# EAGLE design Aux Power Board V1 (EAGLE 9.2.2)

## Sheet 1 of 3
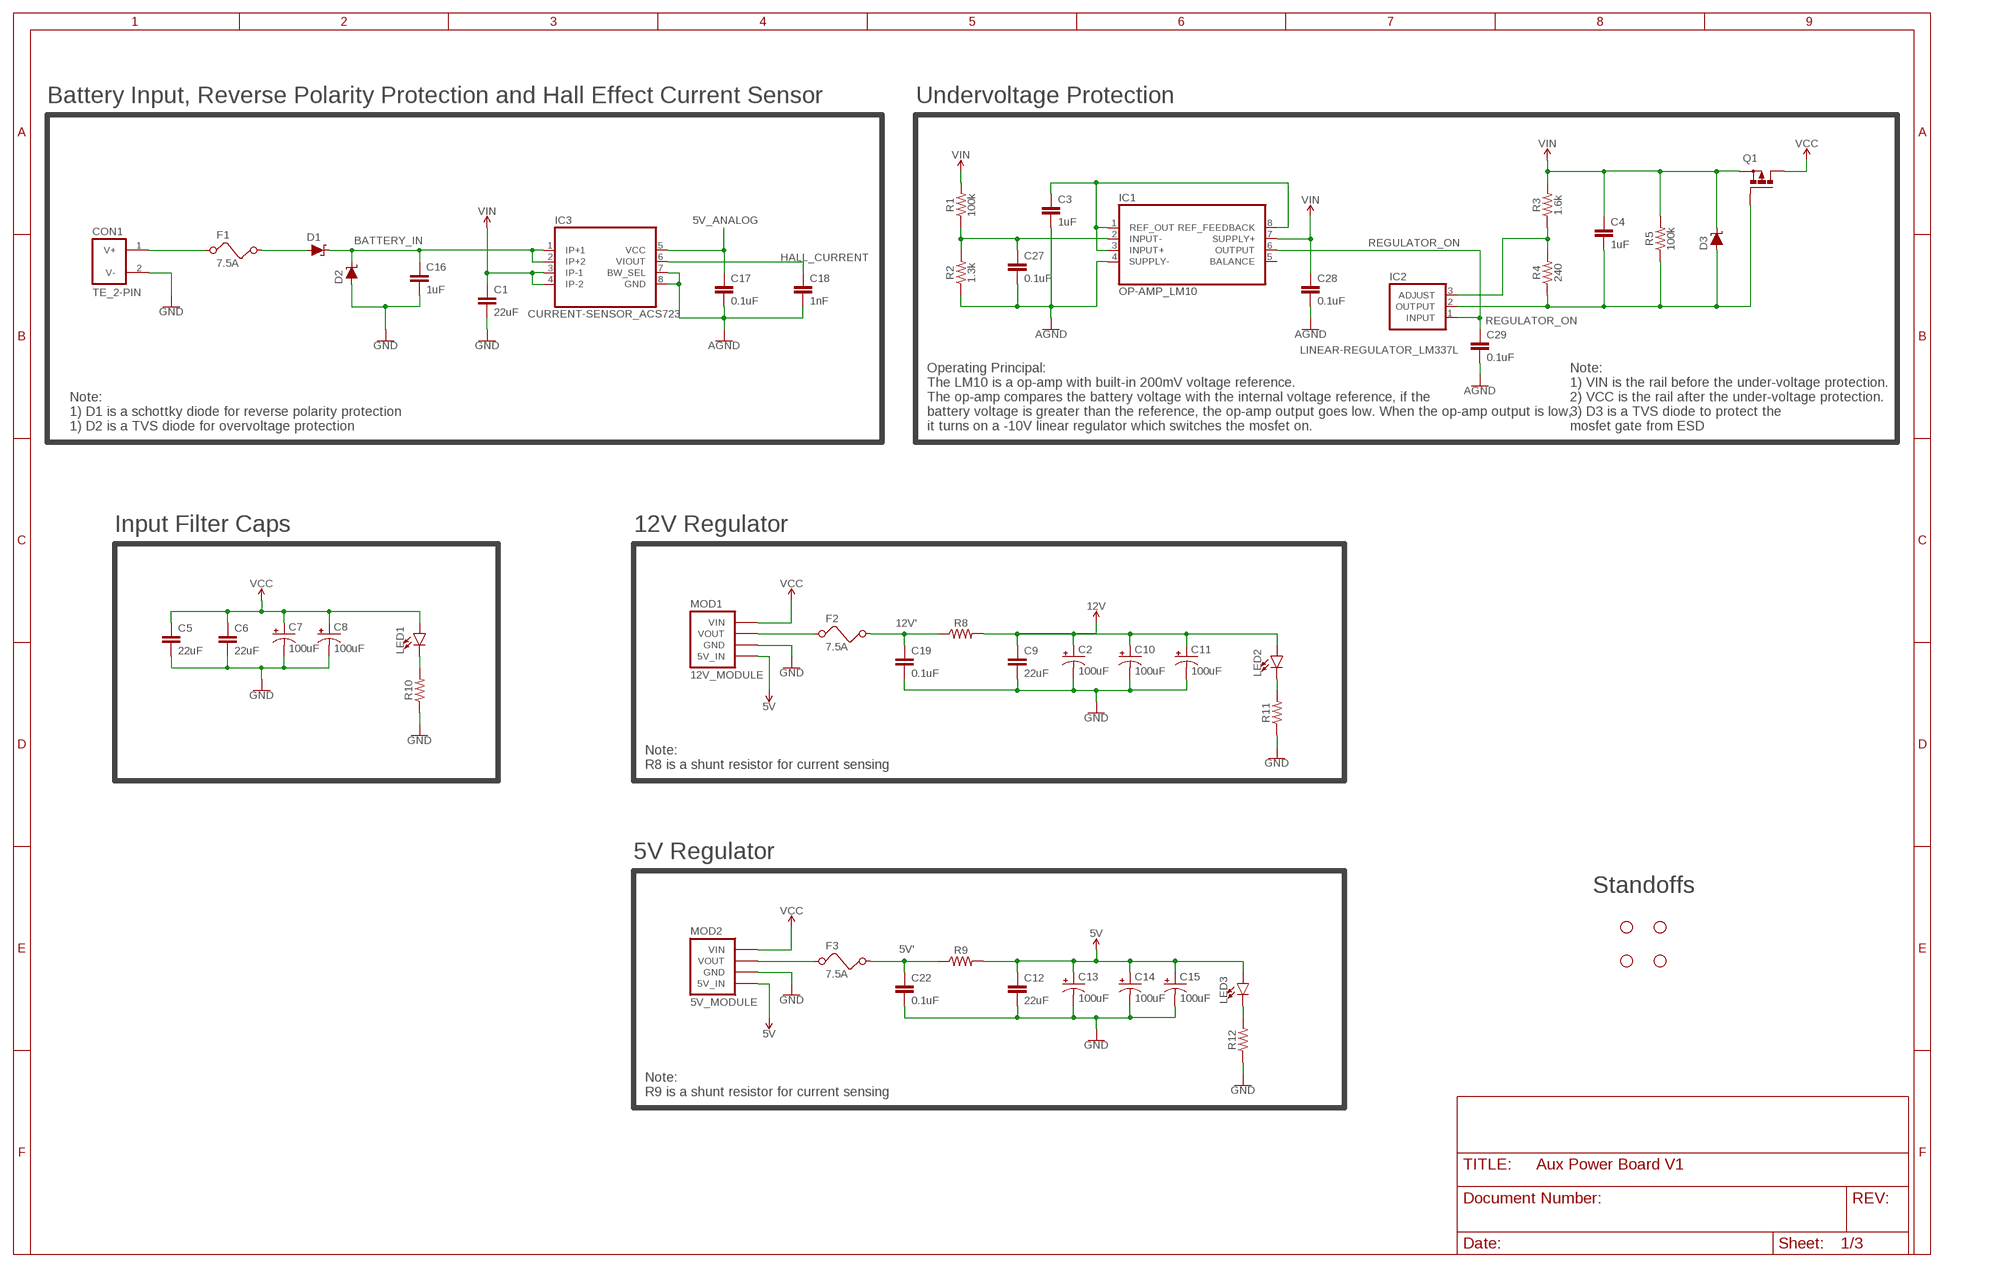
[diagram p0: schematic, sheet 1]

### Parts
C1  22uF  CAPACITOR_1210  [1210]
C2  100uF  CAPACITOR_ELECTROLYTIC_100UF  [CAPACITOR_100UF_50V]
C3  1uF  CAPACITOR_0805  [0805]
C4  1uF  CAPACITOR_0805  [0805]
C5  22uF  CAPACITOR_1210  [1210]
C6  22uF  CAPACITOR_1210  [1210]
C7  100uF  CAPACITOR_ELECTROLYTIC_100UF  [CAPACITOR_100UF_50V]
C8  100uF  CAPACITOR_ELECTROLYTIC_100UF  [CAPACITOR_100UF_50V]
C9  22uF  CAPACITOR_0805  [0805]
C10  100uF  CAPACITOR_ELECTROLYTIC_100UF  [CAPACITOR_100UF_50V]
C11  100uF  CAPACITOR_ELECTROLYTIC_100UF  [CAPACITOR_100UF_50V]
C12  22uF  CAPACITOR_0805  [0805]
C13  100uF  CAPACITOR_ELECTROLYTIC_100UF  [CAPACITOR_100UF_50V]
C14  100uF  CAPACITOR_ELECTROLYTIC_100UF  [CAPACITOR_100UF_50V]
C15  100uF  CAPACITOR_ELECTROLYTIC_100UF  [CAPACITOR_100UF_50V]
C16  1uF  CAPACITOR_0805  [0805]
C17  0.1uF  CAPACITOR_0805  [0805]
C18  1nF  CAPACITOR_0805  [0805]
C19  0.1uF  CAPACITOR_0805  [0805]
C22  0.1uF  CAPACITOR_0805  [0805]
C27  0.1uF  CAPACITOR_0805  [0805]
C28  0.1uF  CAPACITOR_0805  [0805]
C29  0.1uF  CAPACITOR_0805  [0805]
CON1  TE_2-PIN  [TE_2-PIN]
D1  DIODE_SCHOTTKY_TO-263  [TO-263/D2PAK]
D2  DIODE_TVS_DO-214AA  [DO214AA]
D3  DIODE_TVS_DO-214AA  [DO214AA]
F1  7.5A  FUSEHOLDER_VERTICAL  [FUSEHOLDER_VERTICAL]
F2  7.5A  FUSEHOLDER_VERTICAL  [FUSEHOLDER_VERTICAL]
F3  7.5A  FUSEHOLDER_VERTICAL  [FUSEHOLDER_VERTICAL]
H1  STAND-OFF  [STAND-OFF]
H2  STAND-OFF  [STAND-OFF]
H3  STAND-OFF  [STAND-OFF]
H4  STAND-OFF  [STAND-OFF]
IC1  OP-AMP_LM10  [DIP08]
IC2  LINEAR-REGULATOR_LM337L  [TO92]
IC3  CURRENT-SENSOR_ACS723  [SOIC8]
LED1  LED_0805  [0805_LED]
LED2  LED_0805  [0805_LED]
LED3  LED_0805  [0805_LED]
MOD1  12V_MODULE  [5/12V_MODULE]
MOD2  5V_MODULE  [5/12V_MODULE]
Q1  MOSFET_PMOS_TO-263  [TO-263/D2PAK]
R1  100k  RESISTOR_0805  [0805]
R2  1.3k  RESISTOR_0805  [0805]
R3  1.6k  RESISTOR_0805  [0805]
R4  240  RESISTOR_0805  [0805]
R5  100k  RESISTOR_0805  [0805]
R8  RESISTOR_1210  [1210]
R9  RESISTOR_1210  [1210]
R10  RESISTOR_0805  [0805]
R11  RESISTOR_0805  [0805]
R12  RESISTOR_0805  [0805]

### Nets
5V: C12.1 C13.+ C14.+ C15.+ LED3.1(A) MOD1.P$32(5V_IN) MOD2.P$32(5V_IN) R9.2 ; also sheet 2,3
5V': C22.1 F3.3 F3.4 R9.1 ; also sheet 3
5V_ANALOG: C17.1 IC3.5(VCC) ; also sheet 3
12V: C2.+ C9.1 C10.+ C11.+ LED2.1(A) R8.2 ; also sheet 2,3
12V': C19.1 F2.3 F2.4 R8.1 ; also sheet 3
AGND: C3.2 C17.2 C18.2 C27.2 C28.2 C29.2 IC1.4(SUPPLY-) IC3.7(BW_SEL) IC3.8(GND) R2.1 ; also sheet 3
BATTERY_IN: C16.1 D1.2(C) D2.C IC3.1(IP+1) IC3.2(IP+2) ; also sheet 3
GND: C1.2 C2.- C5.2 C6.2 C7.- C8.- C9.2 C10.- C11.- C12.2 C13.- C14.- C15.- C16.2 C19.2 C22.2 CON1.2(V-) D2.A MOD1.P$25(GND) MOD1.P$26(GND) MOD1.P$27(GND) MOD1.P$28(GND) MOD1.P$29(GND) MOD1.P$30(GND) MOD1.P$31(GND) MOD2.P$25(GND) MOD2.P$26(GND) MOD2.P$27(GND) MOD2.P$28(GND) MOD2.P$29(GND) MOD2.P$30(GND) MOD2.P$31(GND) R10.1 R11.1 R12.1 ; also sheet 2,3
HALL_CURRENT: C18.1 IC3.6(VIOUT) ; also sheet 3
N$2: CON1.1(V+) F1.1 F1.2
N$3: D1.3(A) F1.3 F1.4
N$4: LED1.2(C) R10.2
N$5: C3.1 IC1.1(REF_OUT) IC1.3(INPUT+) IC1.8(REF_FEEDBACK)
N$6: C27.1 IC1.2(INPUT-) R1.1 R2.2
N$7: F2.1 F2.2 MOD1.P$9(VOUT) MOD1.P$10(VOUT) MOD1.P$11(VOUT) MOD1.P$12(VOUT) MOD1.P$13(VOUT) MOD1.P$14(VOUT) MOD1.P$15(VOUT) MOD1.P$16(VOUT) MOD1.P$17(VOUT) MOD1.P$18(VOUT) MOD1.P$19(VOUT) MOD1.P$20(VOUT) MOD1.P$21(VOUT) MOD1.P$22(VOUT) MOD1.P$23(VOUT) MOD1.P$24(VOUT)
N$8: C4.2 D3.A IC2.2(OUTPUT) Q1.1(G) R4.1 R5.1
N$9: IC2.3(ADJUST) R3.1 R4.2
N$11: F3.1 F3.2 MOD2.P$9(VOUT) MOD2.P$10(VOUT) MOD2.P$11(VOUT) MOD2.P$12(VOUT) MOD2.P$13(VOUT) MOD2.P$14(VOUT) MOD2.P$15(VOUT) MOD2.P$16(VOUT) MOD2.P$17(VOUT) MOD2.P$18(VOUT) MOD2.P$19(VOUT) MOD2.P$20(VOUT) MOD2.P$21(VOUT) MOD2.P$22(VOUT) MOD2.P$23(VOUT) MOD2.P$24(VOUT)
N$13: LED3.2(C) R12.2
N$17: LED2.2(C) R11.2
REGULATOR_ON: C29.1 IC1.6(OUTPUT) IC2.1(INPUT)
VCC: C5.1 C6.1 C7.+ C8.+ LED1.1(A) MOD1.P$1(VIN) MOD1.P$2(VIN) MOD1.P$3(VIN) MOD1.P$4(VIN) MOD1.P$5(VIN) MOD1.P$6(VIN) MOD1.P$7(VIN) MOD1.P$8(VIN) MOD2.P$1(VIN) MOD2.P$2(VIN) MOD2.P$3(VIN) MOD2.P$4(VIN) MOD2.P$5(VIN) MOD2.P$6(VIN) MOD2.P$7(VIN) MOD2.P$8(VIN) Q1.2(D) ; also sheet 3
VIN: C1.1 C4.1 C28.1 D3.C IC1.7(SUPPLY+) IC3.3(IP-1) IC3.4(IP-2) Q1.3(S) R1.2 R3.2 R5.2
Unconnected: IC1.5(BALANCE)

### Notes on the sheet
- Battery Input, Reverse Polarity Protection and Hall Effect Current Sensor | Undervoltage Protection
- Note: 
  1) D1 is a schottky diode for reverse polarity protection
  1) D2 is a TVS diode for overvoltage protection
- Operating Principal: 
  The LM10 is a op-amp with built-in 200mV voltage reference.
  The op-amp compares the battery voltage with the internal voltage reference, if the 
  battery voltage is greater than the reference, the op-amp output goes low. When the op-amp output is low, 
  it turns on a -10V linear regulator which switches the mosfet on.
- Note: 
  1) VIN is the rail before the under-voltage protection.
  2) VCC is the rail after the under-voltage protection.
  3) D3 is a TVS diode to protect the
  mosfet gate from ESD
- Input Filter Caps | 12V Regulator
- Note: 
  R8 is a shunt resistor for current sensing
- 5V Regulator
- Standoffs
- Note: 
  R9 is a shunt resistor for current sensing

## Sheet 2 of 3
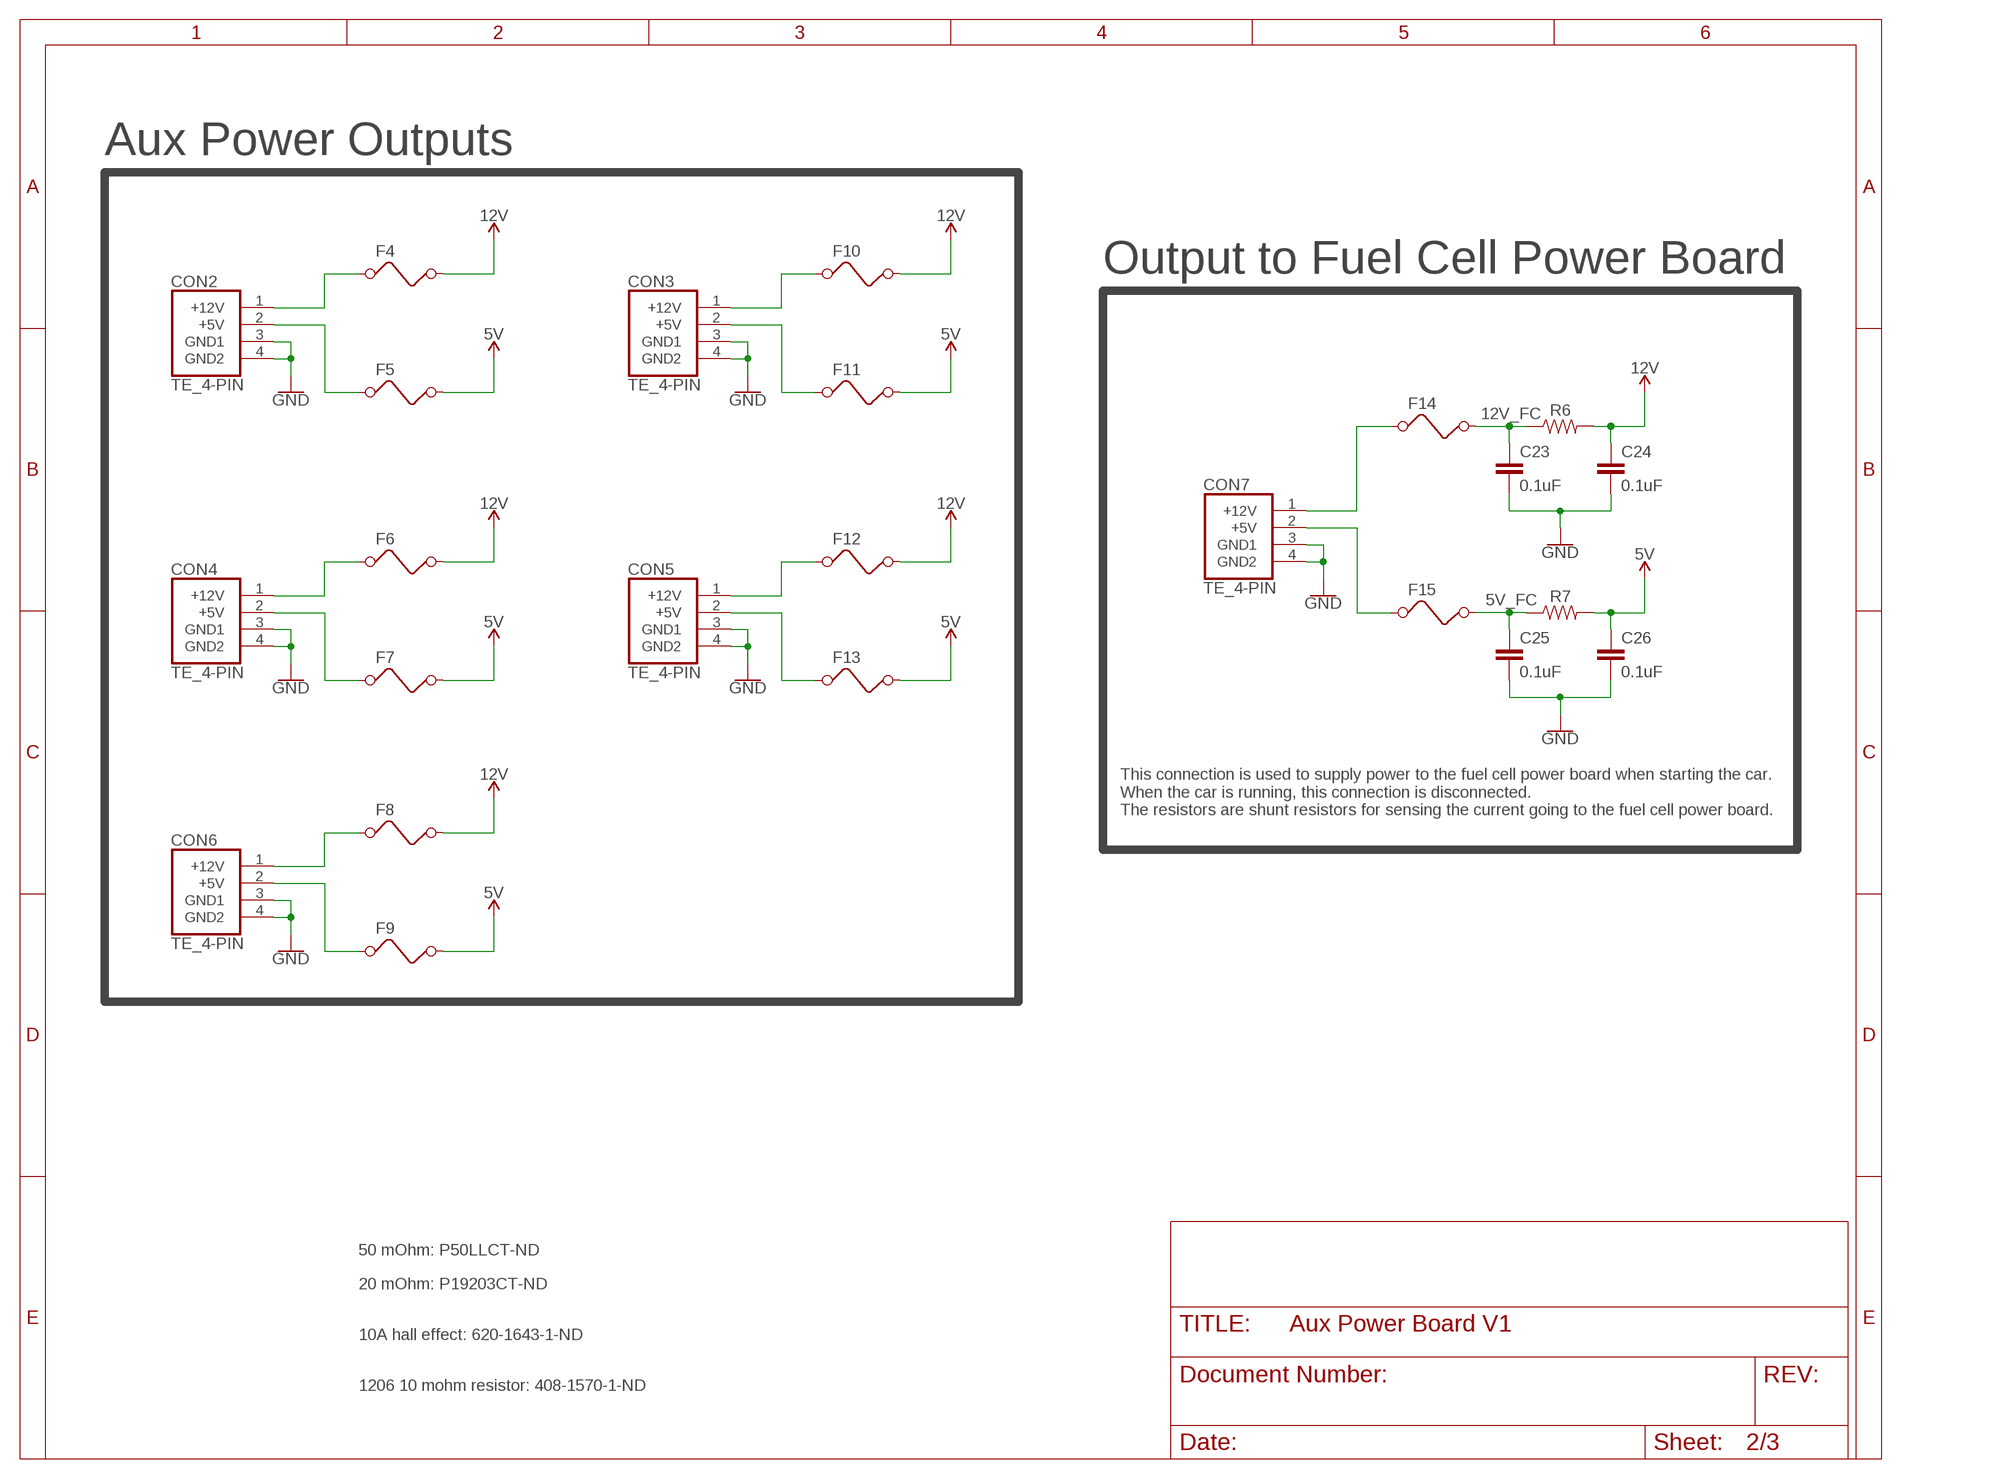
[diagram p1: schematic, sheet 2]

### Parts
C23  0.1uF  CAPACITOR_0805  [0805]
C24  0.1uF  CAPACITOR_0805  [0805]
C25  0.1uF  CAPACITOR_0805  [0805]
C26  0.1uF  CAPACITOR_0805  [0805]
CON2  TE_4-PIN  [TE_4-PIN]
CON3  TE_4-PIN  [TE_4-PIN]
CON4  TE_4-PIN  [TE_4-PIN]
CON5  TE_4-PIN  [TE_4-PIN]
CON6  TE_4-PIN  [TE_4-PIN]
CON7  TE_4-PIN  [TE_4-PIN]
F4  FUSE_1210  [1210]
F5  FUSE_1210  [1210]
F6  FUSE_1210  [1210]
F7  FUSE_1210  [1210]
F8  FUSE_1210  [1210]
F9  FUSE_1210  [1210]
F10  FUSE_1210  [1210]
F11  FUSE_1210  [1210]
F12  FUSE_1210  [1210]
F13  FUSE_1210  [1210]
F14  FUSE_1210  [1210]
F15  FUSE_1210  [1210]
R6  RESISTOR_1210  [1210]
R7  RESISTOR_1210  [1210]

### Nets
5V: C26.1 F5.2 F7.2 F9.2 F11.2 F13.2 R7.2 ; also sheet 1,3
5V_FC: C25.1 F15.2 R7.1 ; also sheet 3
12V: C24.1 F4.2 F6.2 F8.2 F10.2 F12.2 R6.2 ; also sheet 1,3
12V_FC: C23.1 F14.2 R6.1 ; also sheet 3
GND: C23.2 C24.2 C25.2 C26.2 CON2.3(GND1) CON2.4(GND2) CON3.3(GND1) CON3.4(GND2) CON4.3(GND1) CON4.4(GND2) CON5.3(GND1) CON5.4(GND2) CON6.3(GND1) CON6.4(GND2) CON7.3(GND1) CON7.4(GND2) ; also sheet 1,3
N$1: CON2.1(+12V) F4.1
N$10: CON2.2(+5V) F5.1
N$15: CON3.2(+5V) F11.1
N$16: CON3.1(+12V) F10.1
N$19: CON5.2(+5V) F13.1
N$20: CON5.1(+12V) F12.1
N$23: CON4.2(+5V) F7.1
N$24: CON4.1(+12V) F6.1
N$27: CON6.2(+5V) F9.1
N$28: CON6.1(+12V) F8.1
N$31: CON7.2(+5V) F15.1
N$32: CON7.1(+12V) F14.1

### Notes on the sheet
- Aux Power Outputs
- Output to Fuel Cell Power Board
- This connection is used to supply power to the fuel cell power board when starting the car. 
  When the car is running, this connection is disconnected.
  The resistors are shunt resistors for sensing the current going to the fuel cell power board.
- 50 mOhm: P50LLCT-ND
- 20 mOhm: P19203CT-ND
- 10A hall effect: 620-1643-1-ND
- 1206 10 mohm resistor: 408-1570-1-ND

## Sheet 3 of 3
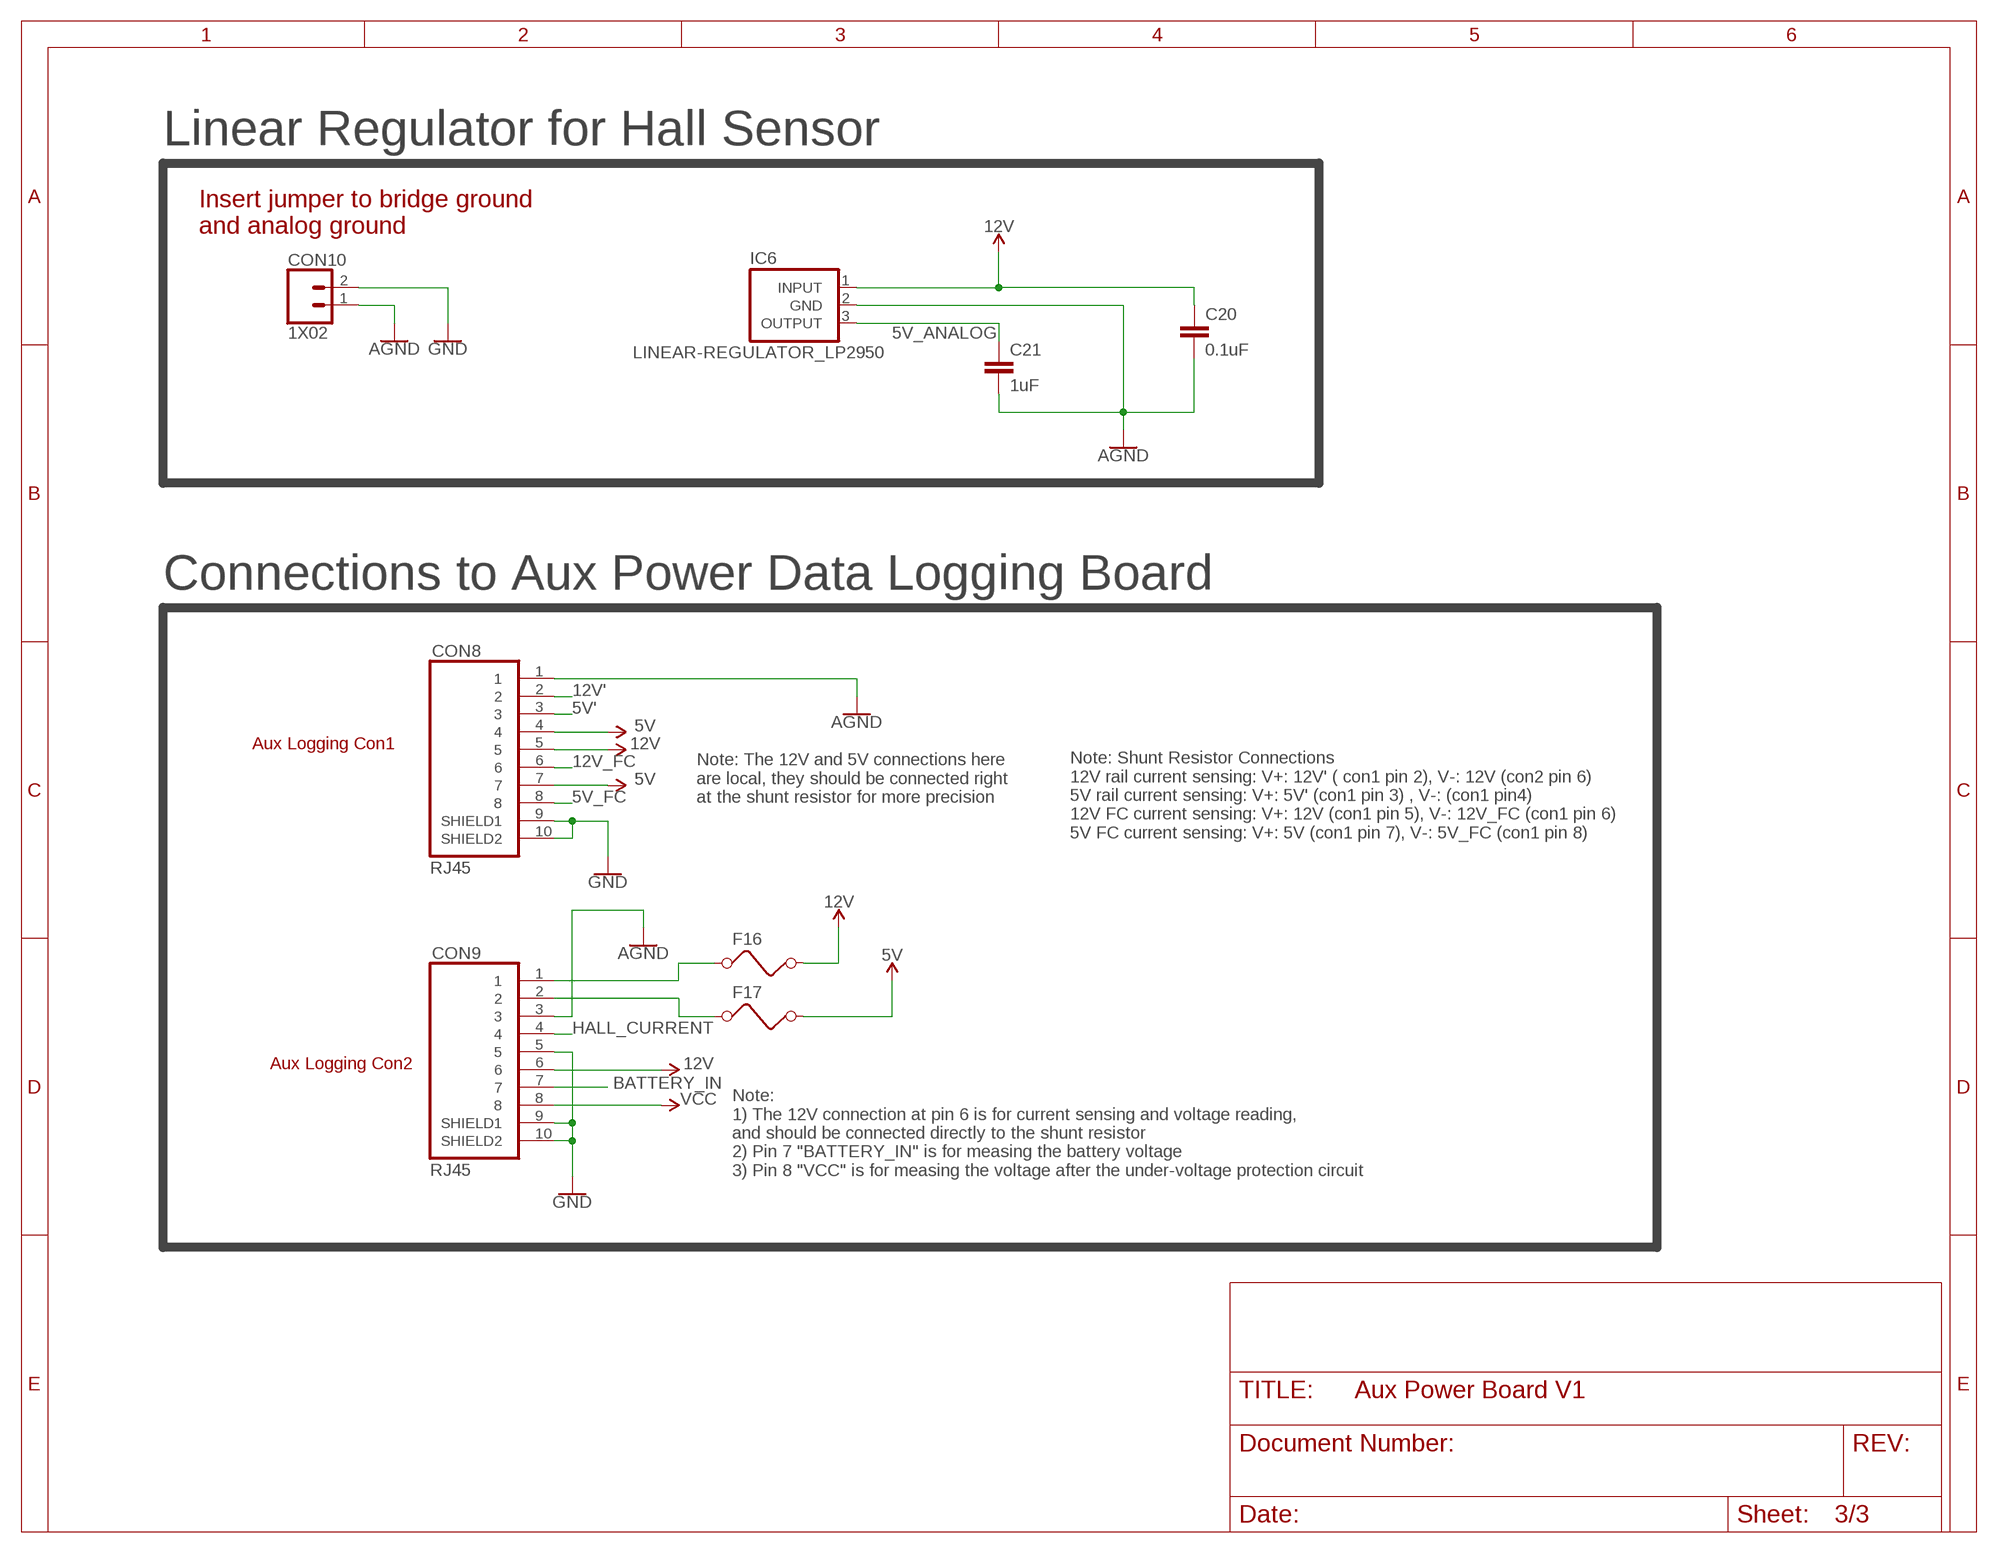
[diagram p2: schematic, sheet 3]

### Parts
C20  0.1uF  CAPACITOR_0805  [0805]
C21  1uF  CAPACITOR_0805  [0805]
CON8  RJ45  [RJ45]
CON9  RJ45  [RJ45]
CON10  1X02  [1X02]
F16  FUSE_1210  [1210]
F17  FUSE_1210  [1210]
IC6  LINEAR-REGULATOR_LP2950  [TO92]

### Nets
5V: CON8.4 CON8.7 F17.2 ; also sheet 1,2
5V': CON8.3 ; also sheet 1
5V_ANALOG: C21.1 IC6.3(OUTPUT) ; also sheet 1
5V_FC: CON8.8 ; also sheet 2
12V: C20.1 CON8.5 CON9.6 F16.2 IC6.1(INPUT) ; also sheet 1,2
12V': CON8.2 ; also sheet 1
12V_FC: CON8.6 ; also sheet 2
AGND: C20.2 C21.2 CON8.1 CON9.3 CON10.1 IC6.2(GND) ; also sheet 1
BATTERY_IN: CON9.7 ; also sheet 1
GND: CON8.9(SHIELD1) CON8.10(SHIELD2) CON9.5 CON9.9(SHIELD1) CON9.10(SHIELD2) CON10.2 ; also sheet 1,2
HALL_CURRENT: CON9.4 ; also sheet 1
N$12: CON9.1 F16.1
N$14: CON9.2 F17.1
VCC: CON9.8 ; also sheet 1

### Notes on the sheet
- Linear Regulator for Hall Sensor
- Insert jumper to bridge ground
  and analog ground
- Connections to Aux Power Data Logging Board
- Aux Logging Con1
- Note: The 12V and 5V connections here
  are local, they should be connected right
  at the shunt resistor for more precision
- Note: Shunt Resistor Connections
  12V rail current sensing: V+: 12V' ( con1 pin 2), V-: 12V (con2 pin 6)
  5V rail current sensing: V+: 5V' (con1 pin 3) , V-: (con1 pin4)
  12V FC current sensing: V+: 12V (con1 pin 5), V-: 12V_FC (con1 pin 6)
  5V FC current sensing: V+: 5V (con1 pin 7), V-: 5V_FC (con1 pin 8)
- Aux Logging Con2
- Note: 
  1) The 12V connection at pin 6 is for current sensing and voltage reading, 
  and should be connected directly to the shunt resistor
  2) Pin 7 "BATTERY_IN" is for measing the battery voltage
  3) Pin 8 "VCC" is for measing the voltage after the under-voltage protection circuit

## Library data of the parts
C1 C5 C6 = EcoCar-Passives:CAPACITOR_1210
C2 C7 C8 C10 C11 C13-C15 = EcoCar-Passives:CAPACITOR_ELECTROLYTIC_100UF: 50V 100uF Electrolytic Capacitor Manufacturer: Nichicon Series: UVZ Part Number: UVZ1H101MPD1TD Digikey Part Number: 493-13464-1-ND
C3 C4 C9 C12 C16-C29 = EcoCar-Passives:CAPACITOR_0805
CON1 = EcoCar-Connectors:TE_2-PIN: 2 Pin TE Mini-Universal MATE-N-LOK - Use for signals and power connections Part Number: 1-770966-0 Digikey Part Number: A32471-ND Matching Plug: A25587-ND Matching Crimps: A100828CT-ND
CON2-CON7 = EcoCar-Connectors:TE_4-PIN: 4 Pin TE Mini-Universal MATE-N-LOK - Use for 12V and 5V connections Part Number: 1-770968-0 Digikey Part Number: A32474-ND Matching Plug: A25571-ND Matching Crimps: A100828CT-ND
CON8 CON9 = EcoCar-Connectors:RJ45: RJ45 Connector - Use for signals and low power connections Unshielded Part Number: RJHSE-5080 Unshielded Digikey Part Number: RJHSE-5080-ND Shielded Part Number: RJHSE5E80 Shielded Digikey Part Number: RJHSE5E80-ND
CON10 = EcoCar-Connectors-2.54mm:1X02: 2.54mm (0.1") Header
D1 = EcoCar-Discrete-Semiconductors:DIODE_SCHOTTKY_TO-263
D2 D3 = EcoCar-Fuses-Protection:DIODE_TVS_DO-214AA
F1-F3 = EcoCar-Fuses-Protection:FUSEHOLDER_VERTICAL: Vertical Fuse Holder for Mini Blade Fuses Manufacturer: Keystone Part Number: 3568 Digikey Part Number: 36-3568-ND
F4-F17 = EcoCar-Fuses-Protection:FUSE_1210: 1210 Surface Mount Fuse
H1-H4 = EcoCar-Miscellaneous:STAND-OFF: Stand Off Drill holes for mechanically mounting via screws, standoffs, etc. Note: Use the keepout ring to avoid running the screw head into surrounding components. Variant Overviews STAND-OFF - Mechanical footprint for a #4 phillips button head screw. STAND-OFF-TIGHT - Mechanical footprint for a #4 phillips button head screw, Example SparkFun Products Screw - Phillips Head (1/4", 4-40, 10 pack) <https://www.sparkfun.com/products/10453> (PRT-10453) Screw - Phillips Head (1/2", 4-40, 10 pack) <https://www.sparkfun.com/products/10452> (PRT-10452) Screw - Phillips Head (3/4", 4-40, 10 pack) <https://www.sparkfun.com/products/10451> (PRT-10451) Screw - Phillips Head (1", 4-40, 10 pack) <https://www.sparkfun.com/products/10450> (PRT-10450)
IC1 = EcoCar-Integrated-Circuits:OP-AMP_LM10: Op-Amp with Internal Voltage Reference Manufacturer: Texas Instruments Part Number: LM10CN/NOPB Digikey Part Number: LM10CN/NOPB-ND
IC2 = EcoCar-Integrated-Circuits:LINEAR-REGULATOR_LM337L: Adjustable Negative Linear Voltage Regulator Manufacturer: Texas Instruments Part Number: LM337LZ/NOPB Digikey Part Number: LM337LZ/NOPB-ND
IC3 = EcoCar-Integrated-Circuits:CURRENT-SENSOR_ACS723: 10A Hall Effect Current Sensor Manufacturer: Allegro MicroSystems Part Number: ACS723LLCTR-10AU-T Digikey Part Number: 620-1643-1-ND
IC6 = EcoCar-Integrated-Circuits:LINEAR-REGULATOR_LP2950: 5V Linear Regulator Manufacturer: Texas Instruments Part Number: LP2950-50LPRE3 Digikey Part Number: 296-20933-1-ND
LED1-LED3 = EcoCar-Discrete-Semiconductors:LED_0805
MOD1 = EcoCar-Modules:12V_MODULE: 12V Regulator Module Notes: 1) if duty cycle > 65%, connect external 5V source to improve efficiency 2) the 12V and 5V regulator modules use the same PCB. Make sure to solder the proper header for 12V or 5V. Use the correct resistor ratio for 12V or 5V.
MOD2 = EcoCar-Modules:5V_MODULE: 5V Regulator Module Notes: 1) if duty cycle > 65%, connect external 5V source to improve efficiency 2) the 12V and 5V regulator modules use the same PCB. Make sure to solder the proper header for 12V or 5V. Use the correct resistor ratio for 12V or 5V.
Q1 = EcoCar-Discrete-Semiconductors:MOSFET_PMOS_TO-263
R1-R5 R10-R12 = EcoCar-Passives:RESISTOR_0805
R6-R9 = EcoCar-Passives:RESISTOR_1210

## Board
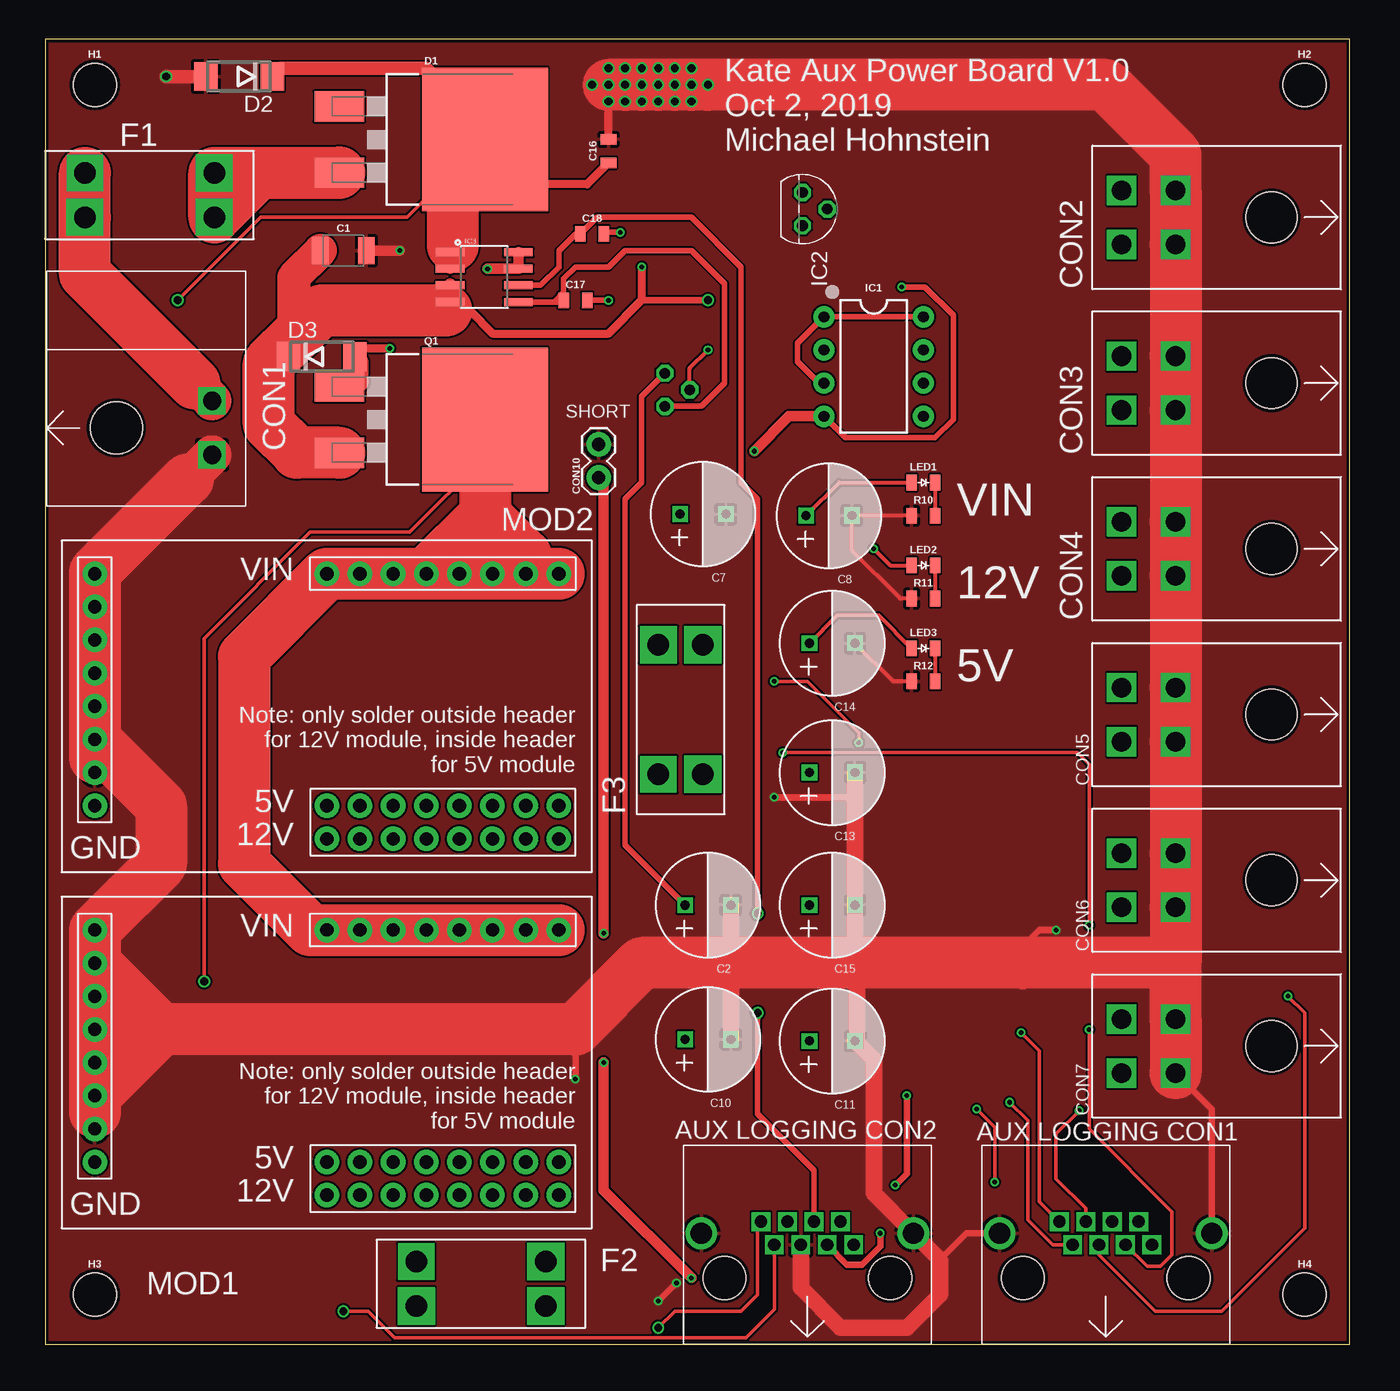
[diagram p3: board, top side]
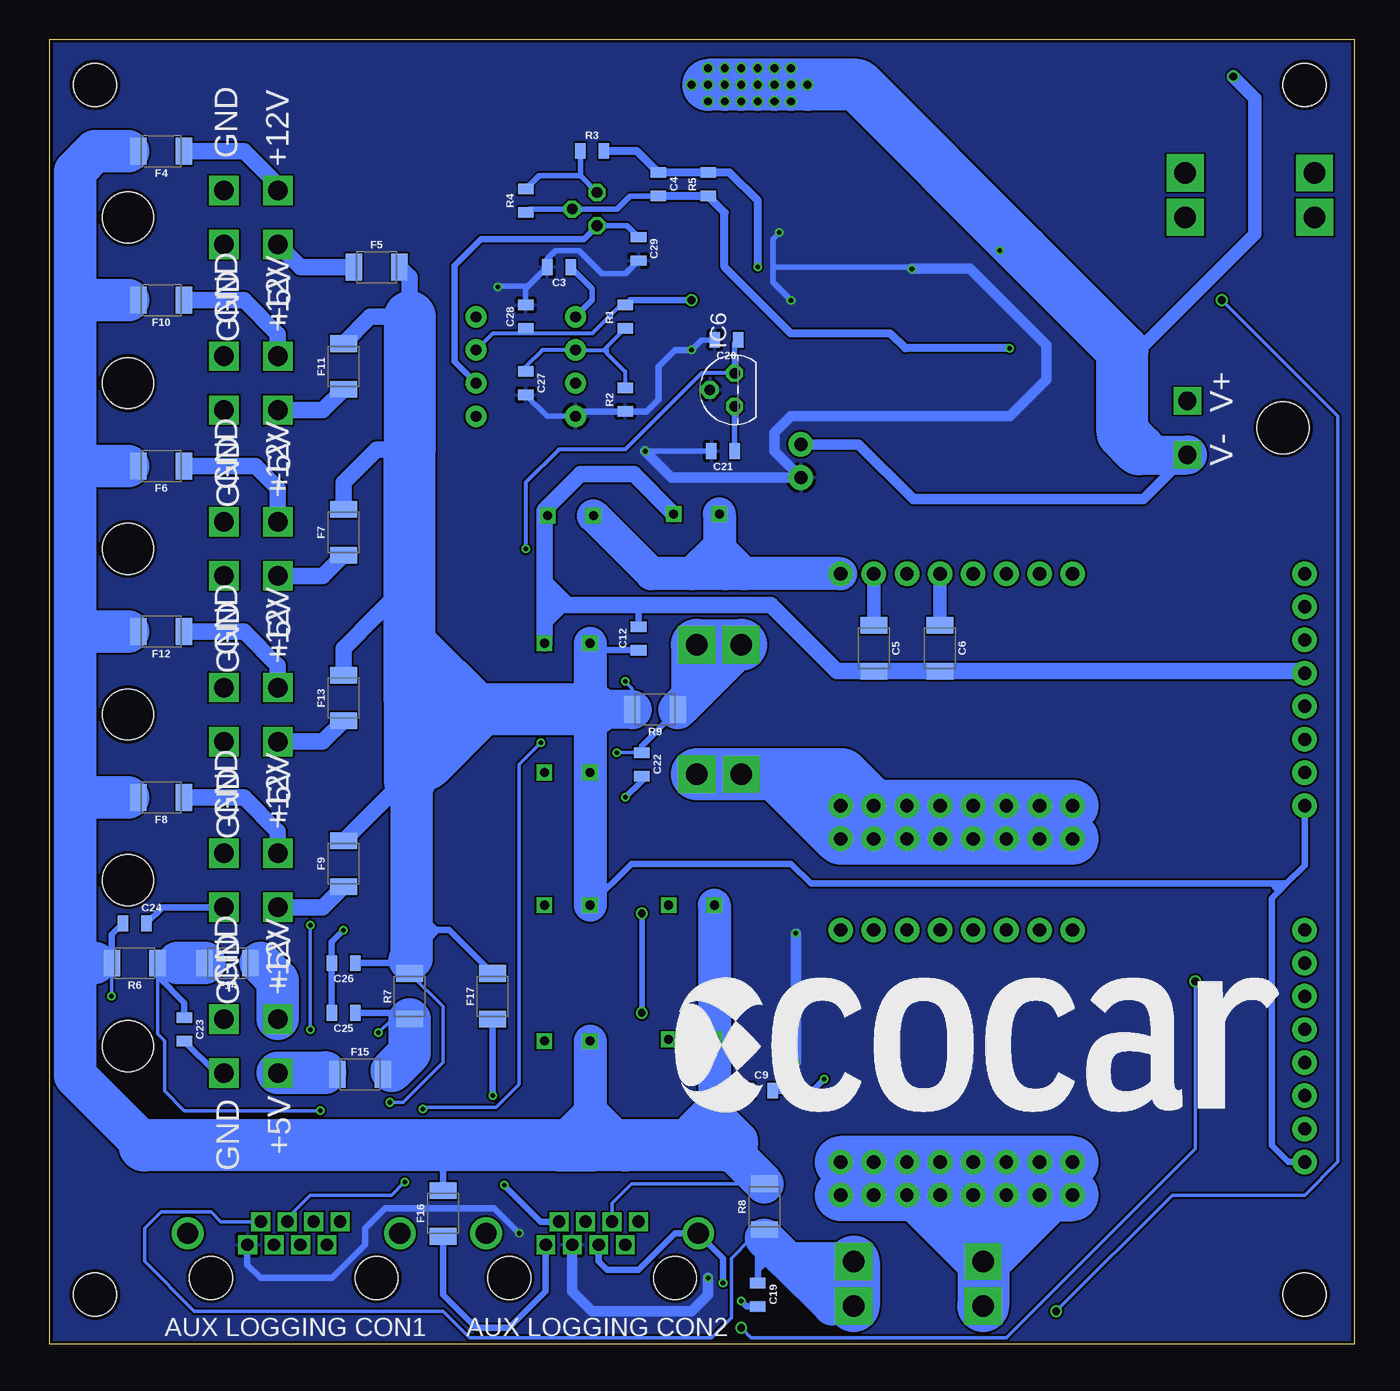
[diagram p4: board, bottom side, seen from below]

Size 100 x 100 mm. Coordinates in mm from the lower left corner, seen from the top.
Outline: 0,0 100,0 100,100 0,100 0,0
Copper layers (1*16): Top 0.035mm / dielectric 1.5mm / Bottom 0.035mm
Design rules "SeeedStudio_2layer_DRU_no_angle_20140221": minimum track width 6mil, minimum drill 12mil, track to track 6mil, track to pad 6mil, pad to pad 6mil, via to via 6mil, smd to smd 0mil, copper to edge 10mil, drill to drill 10mil, minimum pad ring 10mil, minimum via ring 6mil, stop-mask expansion 2mil, vias tented up to drill 100mil, thermal gap 10mil

### Footprints (pad centres in the part's own frame; a part is rotated, then mirrored left to right if it is on the bottom)
1210 = smd 1.27 x 2.06: 1 -1.755,0; 2 1.755,0
CAPACITOR_100UF_50V = drill 0.7 square: + 1.75,0; - -1.75,0
0805 = smd 0.8 x 1.2: 1 -0.9,0; 2 0.9,0
TE_2-PIN = drill 1.4 square: 1 -2.07,12.67; 2 2.07,12.67 | hole 4: 0,5.33
TE_4-PIN = drill 1.5 square: 1 2.07,11.48; 2 -2.07,11.48; 3 2.07,7.34; 4 -2.07,7.34 | hole 3.91: 0,0
RJ45 = drill 0.94 square: 1 9.9,2.54; 2 8.88,4.32; 3 7.87,2.54; 4 6.85,4.32; 5 5.84,2.54; 6 4.82,4.32; 7 3.81,2.54; 8 2.79,4.32 | drill 1.62: 9 -1.78,3.43; 10 14.48,3.43 | hole 3.3: 0,0; 12.7,0
1X02 = drill 1.016 pad 1.88: 1 0,0; 2 2.54,0
TO-263/D2PAK = smd 2.32 x 3.81: 1 -2.54,-7.045; 3 2.54,-7.045 | smd 11 x 9.65: 2 0,4.125
DO214AA = smd 1.8 x 2.2: A 2.55,0; C -2.55,0
FUSEHOLDER_VERTICAL = drill 1.65 pad 2.85 square: 1 3.045,1.665; 3 12.965,1.665; 4 12.965,5.065 | drill 1.65 pad 2.8 square: 2 3.045,5.065
STAND-OFF = hole 3.302: 0,0
DIP08 = drill 0.813 pad 1.626: 1 -3.81,-3.81; 2 -1.27,-3.81; 3 1.27,-3.81; 4 3.81,-3.81; 5 3.81,3.81; 6 1.27,3.81; 7 -1.27,3.81; 8 -3.81,3.81
TO92 = drill 0.813 octagon: 1 1.27,0; 2 0,1.905; 3 -1.27,0
SOIC8 = smd 0.61 x 2.21: 1 -1.905,-2.616; 2 -0.635,-2.616; 3 0.635,-2.616; 4 1.905,-2.616; 5 1.905,2.616; 6 0.635,2.616; 7 -0.635,2.616; 8 -1.905,2.616
0805_LED = smd 0.8 x 1.2: 1 -0.9,0; 2 0.9,0
5/12V_MODULE = drill 1.016 pad 1.88: P$1 2.54,2.54; P$2 5.08,2.54; P$3 7.62,2.54; P$4 10.16,2.54; P$5 12.7,2.54; P$6 15.24,2.54; P$7 17.78,2.54; P$8 20.32,2.54; P$9 2.54,20.32; P$10 5.08,20.32; P$11 7.62,20.32; P$12 10.16,20.32; P$13 12.7,20.32; P$14 15.24,20.32; P$15 17.78,20.32; P$16 20.32,20.32; P$17 2.54,22.86; P$18 5.08,22.86; P$19 7.62,22.86; P$20 10.16,22.86; P$21 12.7,22.86; P$22 15.24,22.86; P$23 17.78,22.86; P$24 20.32,22.86; P$25 38.1,2.54; P$26 38.1,5.08; P$27 38.1,7.62; P$28 38.1,10.16; P$29 38.1,12.7; P$30 38.1,15.24; P$31 38.1,17.78; P$32 38.1,20.32

### Placement (x,y rotation side)
C1  22.86,83.82 0 top
C2  50.8,33.66 180 top
C3  60.96,82.55 180 bottom
C4  53.34,88.9 270 bottom
C5  36.83,53.34 270 bottom
C6  31.75,53.34 270 bottom
C7  50.42,63.63 180 top
C8  60.07,63.5 180 top
C9  45.47,19.43 0 bottom
C10  50.8,23.37 180 top
C11  60.33,23.24 180 top
C12  54.86,54.1 90 bottom
C13  60.33,43.81 180 top
C14  60.33,53.72 180 top
C15  60.33,33.66 180 top
C16  43.18,91.44 90 top
C17  40.64,80.01 0 top
C18  41.91,85.09 0 top
C19  45.72,3.81 270 bottom
C20  48.13,76.96 180 bottom
C21  48.39,68.45 180 bottom
C22  54.61,44.45 270 bottom
C23  89.66,24.13 270 bottom
C24  93.47,32.26 0 bottom
C25  77.47,25.4 180 bottom
C26  77.47,29.21 180 bottom
C27  63.5,73.66 270 bottom
C28  63.5,78.74 90 bottom
C29  54.86,83.95 270 bottom
CON1  0.13,70.23 270 top
CON2  93.98,86.36 90 top
CON3  93.98,73.66 90 top
CON4  93.98,60.96 90 top
CON5  93.98,48.26 90 top
CON6  93.98,35.56 90 top
CON7  93.98,22.86 90 top
CON8  74.93,5.08 0 top
CON9  52.07,5.08 0 top
CON10  42.42,66.42 90 top
D1  29.59,92.33 270 top
D2  14.86,97.16 180 top
D3  21.21,75.69 0 top
F1  0,84.71 0 top
F2  25.4,1.27 0 top
F3  52.07,40.64 90 top
F4  91.44,91.44 180 bottom
F5  74.93,82.55 0 bottom
F6  91.44,67.31 180 bottom
F7  77.47,62.23 90 bottom
F8  91.44,41.91 180 bottom
F9  77.47,36.83 90 bottom
F10  91.44,80.01 180 bottom
F11  77.47,74.93 90 bottom
F12  91.44,54.61 180 bottom
F13  77.47,49.53 90 bottom
F14  86.36,29.21 180 bottom
F15  76.2,20.7 0 bottom
F16  69.85,10.03 90 bottom
F17  66.04,26.67 90 bottom
H1  3.81,96.52 0 top
H2  96.52,96.52 0 top
H3  3.81,3.81 0 top
H4  96.52,3.81 0 top
IC1  63.5,74.93 270 top
IC2  58.04,87 270 top
IC3  33.66,81.79 270 top
IC6  47.5,73.15 90 bottom
LED1  67.31,66.04 0 top
LED2  67.31,59.69 0 top
LED3  67.31,53.34 0 top
MOD1  41.91,34.29 180 top
MOD2  41.91,61.59 180 top
Q1  29.59,70.87 270 top
R1  55.88,78.74 90 bottom
R2  55.88,72.39 90 bottom
R3  58.42,91.44 0 bottom
R4  63.5,87.63 90 bottom
R5  49.53,88.9 90 bottom
R6  93.47,29.21 180 bottom
R7  72.39,26.67 90 bottom
R8  45.21,10.54 90 bottom
R9  53.59,48.64 180 bottom
R10  67.31,63.5 0 top
R11  67.31,57.15 0 top
R12  67.31,50.8 0 top
U$7  ECOCAR_LOGO  [ECOCAR_LOGO_2018]  52.07,17.78 0 bottom

### Tracks (layer width: path | path; a pad name or v marks a point on that pad's centre or on a via)
5V  (via drill 0.35)
  Top 0.254: v73.91,18.54 75.31,17.14 75.31,9.53 77.22,7.62 CON8.7 | v55.88,50.8 58.42,50.8 62.36,46.86 v62.36,46.1 | v71.37,18.03 72.77,16.64 v72.77,12.45
  Top 0.305: C14.+ 60.73,55.88 63.87,55.88 LED3.1
  Bottom 0.254: 55.88,48.11 R9.2 55.35,50.27 v55.88,50.8 | R7.2 69.85,25.89 69.85,21.59 72.9,18.54 v73.91,18.54 | v62.36,46.1 64.01,44.45 64.01,19.94 65.79,18.16 71.25,18.16 v71.37,18.03 | v72.77,12.45 73.79,11.43 80.01,11.43 81.78,9.66 CON8.4
  Bottom 0.508: 66.53,28.43 F17.2 69.36,31.75 70.36,31.75 | 70.36,31.75 71.12,31.75 71.12,33.02 | 72.26,33.02 71.63,33.02 70.36,31.75 | 70.36,31.75 70.36,31.62 70.87,31.11 | C26.1 73.17,29.21 R7.2 | C15.+ 55.4,36.83 43.18,36.83 41.66,35.31 6.35,35.31 | 6.35,35.31 6.1,35.31 | 6.1,35.31 5.21,35.31 | 5.21,35.31 3.81,36.7 MOD2.P$32 | 5.21,35.31 5.65,34.86 | 5.65,34.86 6.35,34.16 6.35,15.24 5.08,13.97 MOD1.P$32 | 5.65,34.86 5.71,34.92 | 5.71,34.92 6.1,35.31 | 5.71,34.92 5.97,34.92 6.35,35.31 | C12.1 58.06,53.2 C14.+ | 74.93,55.88 72.39,58.42 72.39,68.58 74.93,68.58
  Bottom 1.27: F5.2 72.39,81.77 72.39,78.74 75.42,78.74 F11.2 | F7.2 77.47,66.04 74.93,68.58 73.66,68.58 | F13.2 77.47,53.34 74.93,55.88 73.66,57.15 | F9.2 72.88,43.18 72.39,43.18 | 72.26,36.83 72.39,36.7 72.39,29.46 R7.2
  Bottom 2.54: C14.+ 58.58,48.92 58.29,48.64 58.58,48.36 C13.+ C15.+
  Bottom 3: R9.2 58.29,48.64
  Bottom 3.25: 71.12,44.45 72.26,43.31 72.26,36.83 72.26,33.02 72.26,29.59 72.39,29.46
  Bottom 4: 58.29,48.64 67.31,48.64 | 67.31,48.64 71.75,48.64 72.39,49.28 | 72.39,49.28 72.39,53.34 | 72.39,53.34 72.39,68.58 72.39,78.74 | 72.39,49.28 72.39,43.18 | 67.31,48.64 67.31,48.26 71.12,44.45 | 67.31,48.64 72.01,53.34 72.39,53.34
5V'  (via drill 0.35)
  Top 0.254: v56.52,45.34 79.12,45.34 80.01,44.45 v80.01,32.13 | v80.01,24.13 80.01,16.51 86.36,10.16 86.36,6.86 85.47,5.97 84.45,5.97 CON8.3
  Bottom 0.254: C22.1 56.5,45.35 v56.52,45.34 | v80.01,32.13 v80.01,24.13 | R9.1 52.83,47.65
  Bottom 0.508: R9.1 54.61,45.87 C22.1
  Bottom 3: F3.4 47.01,53.48 50.88,49.6 | 50.88,49.6 R9.1 | F3.3 50.88,53.13 50.88,49.6
  Bottom 4: F3.3 F3.4
5V_ANALOG
  Top 0.406: IC6.3 50.29,71.88 52.07,73.66 52.07,81.28 49.53,83.82 44.45,83.82 43.18,82.55 40.64,82.55 39.74,81.65 39.74,80.63 38.99,79.88 | C17.1 39.61,79.88 38.99,79.88 | IC3.5 38.99,79.88
  Bottom 0.406: IC6.3 47.5,68.46 C21.1
5V_FC  (via drill 0.35)
  Top 0.254: v74.8,23.88 76.2,22.48 76.2,10.92 CON8.8
  Bottom 0.254: R7.1 73.76,24.91 v74.8,23.88
  Bottom 0.508: C25.1 72.39,25.4 R7.1 | F15.2 74.04,20.7 73.79,20.95
  Bottom 3.25: R7.1 72.39,22.35 73.79,20.95
12V  (via drill 0.35)
  Top 0.254: v95.25,26.67 96.52,25.4 96.52,8.89 90.17,2.54 85.09,2.54 80.77,6.86 CON8.5
  Top 0.305: v63.5,60.96 64.77,59.69 LED2.1
  Top 0.406: C2.+ 44.45,38.26 44.45,64.77 45.72,66.04 45.72,72.64 IC6.1
  Bottom 0.254: R8.2 55.4,12.3 56.9,10.79 CON9.6 | R6.2 95.25,29.19 v95.25,26.67
  Bottom 0.305: IC6.1 50.04,74.42 55.88,68.58 60.96,68.58 63.5,66.04 v63.5,60.96
  Bottom 0.406: C20.1 47.5,76.7 IC6.1
  Bottom 0.508: F16.2 69.85,15.24 | 48.67,19.43 49.05,19.05 | C24.1 95.23,31.4 R6.2 | 93.98,80.01 F10.2 | F4.2 93.98,91.44 | 93.98,67.31 F6.2 | 93.98,54.61 F12.2 | 93.98,41.91 F8.2 | 98.04,29.21 98.02,29.19 95.25,29.19
  Bottom 0.813: C9.1 48.67,19.43
  Bottom 2.54: C2.+ C10.+ 49.05,19.05 49.05,17.78 | 49.05,17.78 49.05,16.13 48.16,15.24 | 49.05,17.78 49.53,17.78 50.8,16.51 | 49.05,17.78 46.99,15.72 46.99,15.24 | C11.+ 58.58,17.78 | 58.58,17.78 58.58,15.39 58.42,15.24 | 58.58,17.78 58.42,17.78 55.88,15.24 | 58.58,17.78 60.96,15.39 60.96,15.24
  Bottom 3: R8.2 48.16,15.24
  Bottom 3.25: 92.71,15.24 98.04,20.57 98.04,29.21 | 93.98,91.44 96.52,91.44 98.04,89.92 98.04,80.01 | 98.04,41.91 98.04,29.21 | 98.04,41.91 98.04,54.61 | 98.04,54.61 98.04,67.31 | 98.04,67.31 98.04,80.01 | 98.04,80.01 93.98,80.01 | 98.04,67.31 93.98,67.31 | 98.04,54.61 93.98,54.61 | 98.04,41.91 93.98,41.91 | 96.52,29.21 98.04,29.21
  Bottom 4: 48.16,15.24 55.88,15.24 58.42,15.24 60.96,15.24 69.85,15.24 92.71,15.24
12V'
  Bottom 0.254: CON8.2 86.87,9.4 87.63,10.16 91.44,10.16 92.71,8.89 92.71,6.35 88.9,2.54 69.85,2.54 67.82,0.51 49.28,0.51 47.75,2.03 47.75,6.6 46.23,8.13 45.21,8.13
  Bottom 0.508: C19.1 45.72,5.71 | 45.72,5.71 45.72,6.35 | 45.72,6.35 45.72,7.62 | 45.72,6.35 44.45,6.35 | 43.42,6.33 45.1,6.33 45.72,5.71 | 45.21,8.13 R8.1
  Bottom 3: F2.4 43.42,6.33 | 43.42,6.33 45.21,8.13 | F2.3 40.02,2.94 43.42,6.33
  Bottom 4: F2.4 F2.3
12V_FC  (via drill 0.35)
  Top 0.254: v79.25,17.91 77.47,16.13 77.47,12.7 79.75,10.42 CON8.6
  Bottom 0.254: R6.1 91.72,23.77 91.19,23.24 91.19,19.43 89.66,17.91 v79.25,17.91
  Bottom 0.508: C23.1 89.66,26.16 91.72,28.22 R6.1 90.17,29.21
  Bottom 3.25: F14.2 90.17,29.21
AGND  (via drill 0.35)
  Top 0.305: IC6.2 49.4,74.8 v50.8,76.2
  Top 0.406: C18.2 42.94,85.22 v44.07,85.22 | v43.18,80.01 C17.2 | v65.66,81.03 67.44,81.03 69.6,78.87 69.6,70.87 68.2,69.47 61.34,69.47 IC1.4
  Top 0.508: CON9.3 61.46,6.1 62.61,6.1 64.01,7.49 v64.01,8.51 | 36.27,82.55 IC3.7
  Top 0.813: v54.36,68.45 57.02,71.12 IC1.4 | IC3.8 36.27,82.55 | IC3.7 v33.91,82.42 | CON10.1 42.8,66.04 v42.8,31.5 | v42.8,21.59 42.8,11.81 v49.53,5.08
  Bottom 0.406: v44.07,85.22 44.58,84.71 44.58,82.55 | v43.18,80.01 44.58,81.41 44.58,82.55 | v33.91,82.42 34.04,82.55 44.58,82.55 | C20.2 50.04,76.96 v50.8,76.2 | C29.2 55.87,82.04 57.66,82.04 59.44,83.82 61.21,83.82 61.86,83.17 C3.2 63.31,81.09 | 63.31,81.09 63.5,80.91 C28.2 | 63.31,81.09 65.59,81.09 v65.66,81.03 | C27.2 61.86,71.12 IC1.4 | v54.36,68.45 C21.2
  Bottom 0.508: v50.8,76.2 52.07,76.2 53.34,74.93 53.34,72.39 54.24,71.49 R2.1 59.32,71.49 IC1.4 | v64.01,8.51 65.91,10.41 74.3,10.41 75.82,8.89 75.82,7.62 78.36,5.08 83.82,5.08 84.84,6.1 CON8.1
  Bottom 0.813: v54.36,68.45 52.32,66.42 CON10.1 44.45,68.45 44.45,69.85 43.18,71.12 26.42,71.12 23.62,73.91 23.62,76.58 29.46,82.42 v33.91,82.42 | v42.8,31.5 v42.8,21.59 | v49.53,5.08 49.53,3.81 50.8,2.54 58.42,2.54 59.94,4.06 CON9.3
  pour Bottom: -3.81,104.14 104.14,104.14 104.14,-3.81 -3.81,-3.81
BATTERY_IN  (via drill 0.6)
  Top 0.254: 33.56,92.17 27.75,86.36 16.51,86.36 v10.16,80.01 | v22.86,2.54 24.77,2.54 26.8,0.51 53.72,0.51 55.88,2.67 CON9.7
  Top 0.508: 35.18,92.33 37.72,92.33 38.1,92.71 | 31.75,95.25 33.72,93.28 D1.2 35.94,92.33 36.83,91.44
  Top 0.61: C16.1 41.54,88.9 36.83,88.9 36.83,91.44 36.83,92.71
  Top 0.813: 34.23,91.81 D1.2 | IC3.2 IC3.1
  Top 1.016: D2.C 18.04,97.79 29.21,97.79 29.84,97.16 | 31.75,95.25 29.84,97.16 | 29.84,97.16 29.84,96.2 D1.2 35.18,92.33 35.56,92.71 35.13,92.71 34.23,91.81
  Top 2.54: IC3.1 31.04,84 31.24,84.2
  Top 4: D1.2 33.56,92.17 31.24,89.86 31.24,84.2
  Bottom 0.254: v10.16,80.01 1.27,71.12 1.27,13.97 3.81,11.43 13.97,11.43 v22.86,2.54
GND  (via drill 0.35, 0.6)
  Top 0.305: R11.1 65.53,57.15 61.85,60.83 61.85,63.47 | 61.85,63.47 C8.- | R10.1 61.88,63.5 61.85,63.47 | R12.1 65,50.8 C14.-
  Top 0.508: 62.08,41.91 v55.88,41.91 | 68.58,6.48 70.61,8.51 CON8.9 | CON7.4 89.41,18.02 CON8.10 | v46.99,3.3 v48.39,4.7 | v40.64,20.32 40.64,24.13 | v77.47,31.75 76.2,31.75 74.93,30.48 74.93,29.21 | v44.45,97.79 v45.72,97.79 v45.72,96.52 | v43.18,96.52 v43.18,95.25 | v48.26,95.25 v46.99,95.25 v45.72,95.25 v44.45,95.25 | MOD2.P$31 MOD2.P$30
  Top 0.61: C16.2 v43.18,95.25
  Top 0.813: C1.2 v27.18,83.82
  Top 1.016: v9.27,97.16 D2.A
  Top 1.27: MOD1.P$30 MOD1.P$31 | C13.- 62.08,41.91 C15.- 62.08,29.36 62.23,29.21 62.23,23.4 C11.- 63.5,21.82 63.5,11.56 CON9.10 68.58,6.48 68.58,3.81 66.04,1.27 60.96,1.27 57.91,4.32 CON9.5 | C2.- 52.55,29.69 | 52.55,29.69 52.07,29.21 | 52.55,29.69 C10.-
  Top 3: CON1.2 10.93,66.29 10.92,66.29
  Top 4: 10.93,66.29 3.81,59.17 MOD2.P$25 MOD2.P$26 MOD2.P$27 MOD2.P$28 MOD2.P$29 MOD2.P$30 | MOD2.P$30 3.81,44.96 | MOD2.P$30 8.89,41.27 8.89,36.83 MOD1.P$25 MOD1.P$26 | MOD1.P$26 MOD1.P$27 MOD1.P$28 | MOD1.P$28 MOD1.P$29 3.81,17.78 | 86.64,29.21 CON6.4 CON6.3 CON5.4 CON5.3 CON4.4 CON4.3 CON3.4 CON3.3 CON2.4 CON2.3 86.64,91.16 81.28,96.52 v50.8,96.52 v49.53,96.52 v48.26,96.52 v46.99,96.52 v45.72,96.52 v44.45,96.52 v43.18,96.52 | 86.64,29.21 CON7.3 CON7.4 | 86.64,29.21 74.93,29.21 62.23,29.21 52.07,29.21 45.72,29.21 40.64,24.13 8.89,24.13 | 8.89,24.13 MOD1.P$28 | MOD1.P$26 8.89,24.13 | MOD1.P$30 8.89,24.13
  Bottom 0.508: C12.2 54.86,56.39 54.61,56.64 | C24.2 91.34,33.49 CON6.4 | v55.88,41.91 54.61,43.18 C22.2 | C23.2 87.22,20.79 CON7.4 | C19.2 46.6,2.91 v46.99,3.3 | v48.39,4.7 48.39,6.61 CON9.9 52.07,8.51 54.86,5.71 57.28,5.71 57.91,6.35 CON9.5 | C9.2 41.53,19.43 v40.64,20.32 | v43.18,97.79 v44.45,97.79 | v49.53,97.79 v48.26,97.79 v46.99,97.79 v45.72,97.79 | v46.99,96.52 v46.99,95.25 | v48.26,95.25 v49.53,95.25 | C25.2 C26.2 78.37,30.85 v77.47,31.75
  Bottom 0.813: CON1.2 16.19,64.77 33.8,64.77 38,68.96 CON10.2 | v27.18,83.82 25.4,83.82
  Bottom 1.016: 17.78,76.2 16.51,76.2 7.62,85.09 7.62,95.5 v9.27,97.16
  Bottom 1.27: C7.- 55.22,66.67 59.31,66.67 61.82,64.16 | 61.82,64.16 C8.- 62.08,63.25 | 62.08,63.25 62.08,58.42 | 62.08,58.42 62.08,55.37 | 62.08,55.37 C14.- | 61.82,64.16 62.08,63.91 62.08,63.25 | 62.08,58.42 60.3,56.64 | 60.3,56.64 54.61,56.64 44.7,56.64 39.65,51.59 C5.2 C6.2 3.96,51.59 MOD2.P$28 | 60.3,56.64 60.8,56.64 62.08,55.37
  Bottom 3: 16.51,68.58 16.09,68.16 CON1.2
  Bottom 4: 16.51,68.58 17.78,69.85 17.78,76.2 25.4,83.82 38.1,96.52 v41.91,96.52 v43.18,96.52 v44.45,96.52 v45.72,96.52 v46.99,96.52 v48.26,96.52 v49.53,96.52
  pour Top: -2.54,-2.54 -2.54,102.87 102.87,102.87 102.87,-2.54
HALL_CURRENT  (via drill 0.6)
  Top 0.406: IC3.6 37.97,81.15 39.37,82.55 39.37,83.82 40.64,85.09 C18.1 42.28,86.36 49.53,86.36 53.34,82.55 53.34,66.04 54.61,64.77 v54.61,33.02 | CON9.4 58.93,13.34 54.61,17.65 v54.61,25.4
  Bottom 0.406: v54.61,33.02 v54.61,25.4
N$1
  Bottom 1.27: F4.1 85.09,91.44 82.5,88.85 CON2.1
N$2
  Top 3: CON1.1 11.44,73.66 11.43,73.66
  Top 4: F1.2 F1.1 3.04,82.05 11.43,73.66
N$3
  Top 4: 16.36,89.77 F1.4 F1.3 16.36,89.77 | D1.3 22.53,89.77 19.05,89.77 16.36,89.77
N$4
  Top 0.305: LED1.2 R10.2
N$5
  Top 0.406: IC1.8 IC1.1 57.66,76.71 57.66,75.31 59.31,73.66 IC1.3
  Bottom 0.406: C3.1 58.42,80.91 58.42,80.01 IC1.1
N$6
  Bottom 0.305: C27.1 63.5,74.93 62.23,76.2 IC1.2 57.52,76.2 | 57.52,76.2 57.27,76.45 | 57.27,76.45 R1.1 | 57.52,76.2 57.34,76.02 | 57.34,76.02 55.88,74.56 R2.2 | 57.34,76.02 57.27,76.08 57.27,76.45
N$7
  Bottom 1.27: MOD1.P$20 MOD1.P$19 | MOD1.P$21 MOD1.P$13 MOD1.P$14 | MOD1.P$23 MOD1.P$22 | MOD1.P$11 MOD1.P$10
  Bottom 2.54: MOD1.P$23 MOD1.P$15 | MOD1.P$10 MOD1.P$18
  Bottom 4: MOD1.P$16 MOD1.P$15 MOD1.P$13 MOD1.P$12 MOD1.P$10 MOD1.P$9 | MOD1.P$21 MOD1.P$22 MOD1.P$24 23.35,11.43 F2.2 | MOD1.P$21 MOD1.P$19 | MOD1.P$19 MOD1.P$18 MOD1.P$17 | MOD1.P$21 28.45,10.66 F2.2 | F2.2 F2.1 | F2.2 33.54,11.43 MOD1.P$19
N$8  (via drill 0.35)
  Top 0.508: Q1.1 23.43,74.3 23.5,74.3
  Top 0.61: D3.A 24.39,76.33 v26.42,76.33
  Top 1.016: Q1.1 23.18,74.04
  Top 1.27: 22.86,73.66 23.5,74.3 23.76,74.56 D3.A 24.13,75.32 24.13,73.66
  Bottom 0.406: C4.2 55.51,88 56.52,87 IC2.2 63.23,87 R4.1
  Bottom 0.61: v26.42,76.33 34.42,76.33 35.56,77.47 43.18,77.47 48.26,82.55 48.26,86.73 R5.1 C4.2
N$9
  Bottom 0.406: R3.1 59.32,89.55 | IC2.3 59.32,89.55 | 59.32,89.55 62.48,89.55 R4.2
N$10
  Bottom 1.27: CON2.2 80.76,82.55 F5.1
N$11
  Bottom 2.54: MOD2.P$9 MOD2.P$17 | MOD2.P$18 MOD2.P$10 | MOD2.P$11 MOD2.P$19 | MOD2.P$12 MOD2.P$20 | MOD2.P$21 MOD2.P$13 | MOD2.P$22 MOD2.P$14 MOD2.P$15 | MOD2.P$15 MOD2.P$23 | MOD2.P$15 MOD2.P$16 MOD2.P$24
  Bottom 4: MOD2.P$16 MOD2.P$14 MOD2.P$13 MOD2.P$12 MOD2.P$11 MOD2.P$10 | MOD2.P$9 MOD2.P$10 | MOD2.P$24 MOD2.P$23 MOD2.P$22 MOD2.P$21 MOD2.P$20 MOD2.P$19 MOD2.P$18 MOD2.P$17 44.32,43.69 F3.2 | MOD2.P$10 39.24,43.69 F3.2 | F3.2 F3.1
N$12
  Bottom 0.508: CON9.1 61.97,4.07 64.77,1.27 67.31,1.27 69.85,3.81 F16.1
N$13
  Top 0.305: LED3.2 R12.2
N$14  (via drill 0.35)
  Top 0.508: v65.15,12.19 66.04,13.08 v66.04,19.05
  Bottom 0.508: F17.1 v66.04,19.05 | v65.15,12.19 62.36,9.4 CON9.2
N$15
  Bottom 1.27: F11.1 79.06,71.59 CON3.2
N$16
  Bottom 1.27: F10.1 85.09,80.01 82.5,77.42 CON3.1
N$17
  Top 0.305: LED2.2 R11.2
N$19
  Bottom 1.27: F13.1 79.06,46.19 CON5.2
N$20
  Bottom 1.27: F12.1 85.09,54.61 82.5,52.02 CON5.1
N$23
  Bottom 1.27: F7.1 79.06,58.89 CON4.2
N$24
  Bottom 1.27: F6.1 84.2,67.31 82.5,65.61 CON4.1
N$27
  Bottom 1.27: F9.1 79.06,33.49 CON6.2
N$28
  Bottom 1.27: F8.1 85.09,41.91 82.5,39.32 CON6.1
N$31
  Bottom 1.27: F15.1 78.04,20.79 78.91,20.79
  Bottom 3.25: CON7.2 78.91,20.79 78.87,20.83
N$32
  Bottom 0.508: 83.82,29.21 F14.1
  Bottom 3.25: CON7.1 82.5,27.89 83.82,29.21
REGULATOR_ON
  Bottom 0.406: IC2.1 55.74,85.72 C29.1
  Bottom 0.508: IC2.1 59.05,84.71 66.93,84.71 68.96,82.68 68.96,75.31 IC1.6
VCC  (via drill 0.6)
  Top 0.254: v46.99,1.27 48.26,2.54 53.34,2.54 54.61,3.81 54.61,9.15 CON9.8 | Q1.2 33.72,68.01 27.94,62.23 20.32,62.23 12.19,54.1 v12.19,27.81
  Top 0.305: C8.+ 60.86,66.04 LED1.1
  Top 2.54: MOD1.P$7 20.32,31.75
  Top 4: Q1.2 33.72,63.56 | 33.72,63.56 MOD2.P$5 | MOD1.P$1 MOD1.P$2 MOD1.P$3 MOD1.P$4 MOD1.P$5 MOD1.P$6 MOD1.P$7 MOD1.P$8 20.32,31.75 15.24,36.83 15.24,52.7 MOD2.P$8 MOD2.P$7 MOD2.P$6 MOD2.P$5 | MOD2.P$2 36.83,60.45 33.72,63.56 | MOD2.P$5 MOD2.P$4 MOD2.P$3 MOD2.P$2 | MOD2.P$2 MOD2.P$1
  Bottom 0.254: v46.99,1.27 46.23,0.51 26.67,0.51 12.19,14.99 v12.19,27.81
  Bottom 1.016: C6.1 MOD2.P$4 | C5.1 MOD2.P$2
  Bottom 2.54: MOD2.P$1 46.76,59.05 | 46.76,59.05 48.26,59.05 | 48.26,59.05 50.8,59.05 | 50.8,59.05 53.88,59.05 C8.+ | C7.+ 48.67,60.96 | 48.67,60.96 48.67,59.46 48.26,59.05 | 48.67,60.96 46.76,59.05 | 48.67,60.96 48.9,60.96 50.8,59.05
VIN  (via drill 0.35, 0.6)
  Top 0.508: 45.72,80.01 v50.8,80.01 | 16.51,76.2 17.02,75.69 D3.C 18.66,75.32 19.05,74.93 19.24,75.12 19.24,77.28
  Top 0.61: 30.73,79.25 32.51,79.25 34.29,77.47 43.18,77.47 45.72,80.01 v45.72,82.55
  Top 0.813: 19.05,78.74 19.05,77.47 19.24,77.28
  Top 1.016: IC3.3 IC3.4
  Top 1.27: IC3.4 31.04,79.55 30.73,79.25
  Top 2.54: C1.1 19.05,81.77 19.05,78.74 | 21.21,79.25 20.83,79.25 19.05,77.47
  Top 4: Q1.3 19.3,68.33 17.14,70.48 17.14,75.18 19.24,77.28 21.21,79.25 30.73,79.25
  Bottom 0.305: IC1.7 66.04,77.47 63.5,77.47 | C28.1 63.5,77.47 | 56.25,79.64 58.42,77.47 63.5,77.47
  Bottom 0.406: R1.2 56.25,79.64
  Bottom 0.508: v50.8,80.01 55.51,80.01 R1.2
  Bottom 0.61: v45.72,82.55 45.72,87.63 47.89,89.8 R5.2 C4.1 54.98,91.44 R3.2

### Text on the board
tPlace: Kate Aux Power Board V1.0 / Oct 2, 2019 / Michael Hohnstein | SHORT | VIN | 12V | 5V
tNames: AUX LOGGING CON2 | AUX LOGGING CON1
bNames: AUX LOGGING CON2 | AUX LOGGING CON1